# EAGLE design momav_esc (EAGLE 9.6.1)
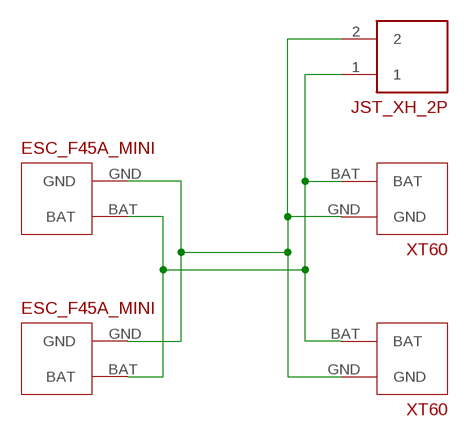
[diagram p0: schematic, sheet 1]

## Parts
U$1  ESC_F45A_MINI  [ESC_F45A_MINI]
U$2  ESC_F45A_MINI  [ESC_F45A_MINI]
U$3  CONN_XT60  [CONN_XT60]
U$4  CONN_XT60  [CONN_XT60]
U$5  JST_XH_2P  [JST_XH_2P]

## Nets
N$1: U$1.GND U$2.GND U$3.GND U$4.GND U$5.2
N$4: U$1.BAT U$2.BAT U$3.BAT U$4.BAT U$5.1

## Library data of the parts
U$1 U$2 = _custom:ESC_F45A_MINI
U$3 U$4 = _custom:CONN_XT60
U$5 = _custom:JST_XH_2P

## Board
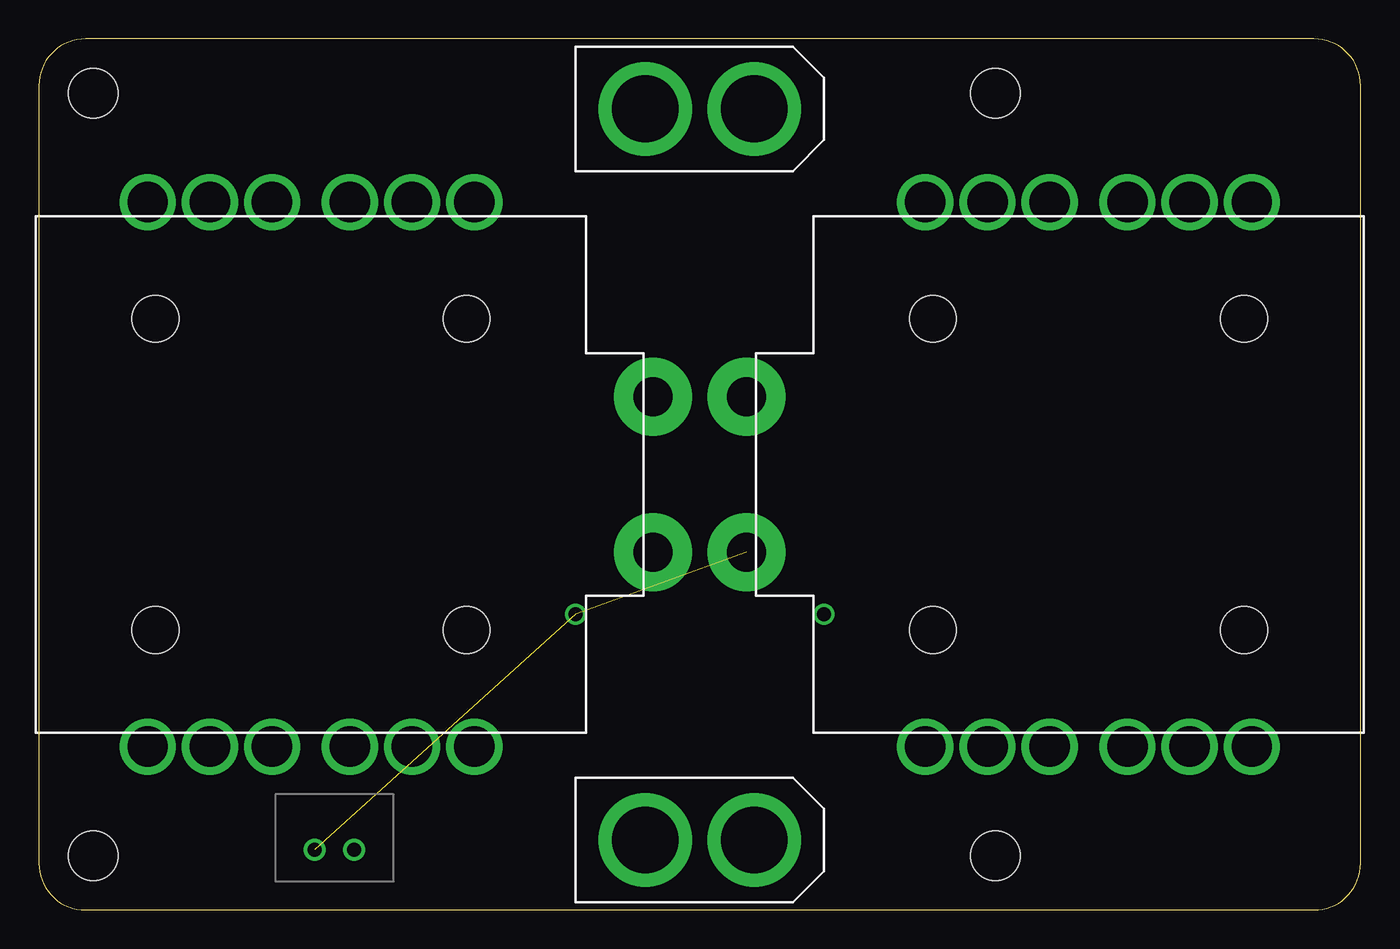
[diagram p1: board, top side]
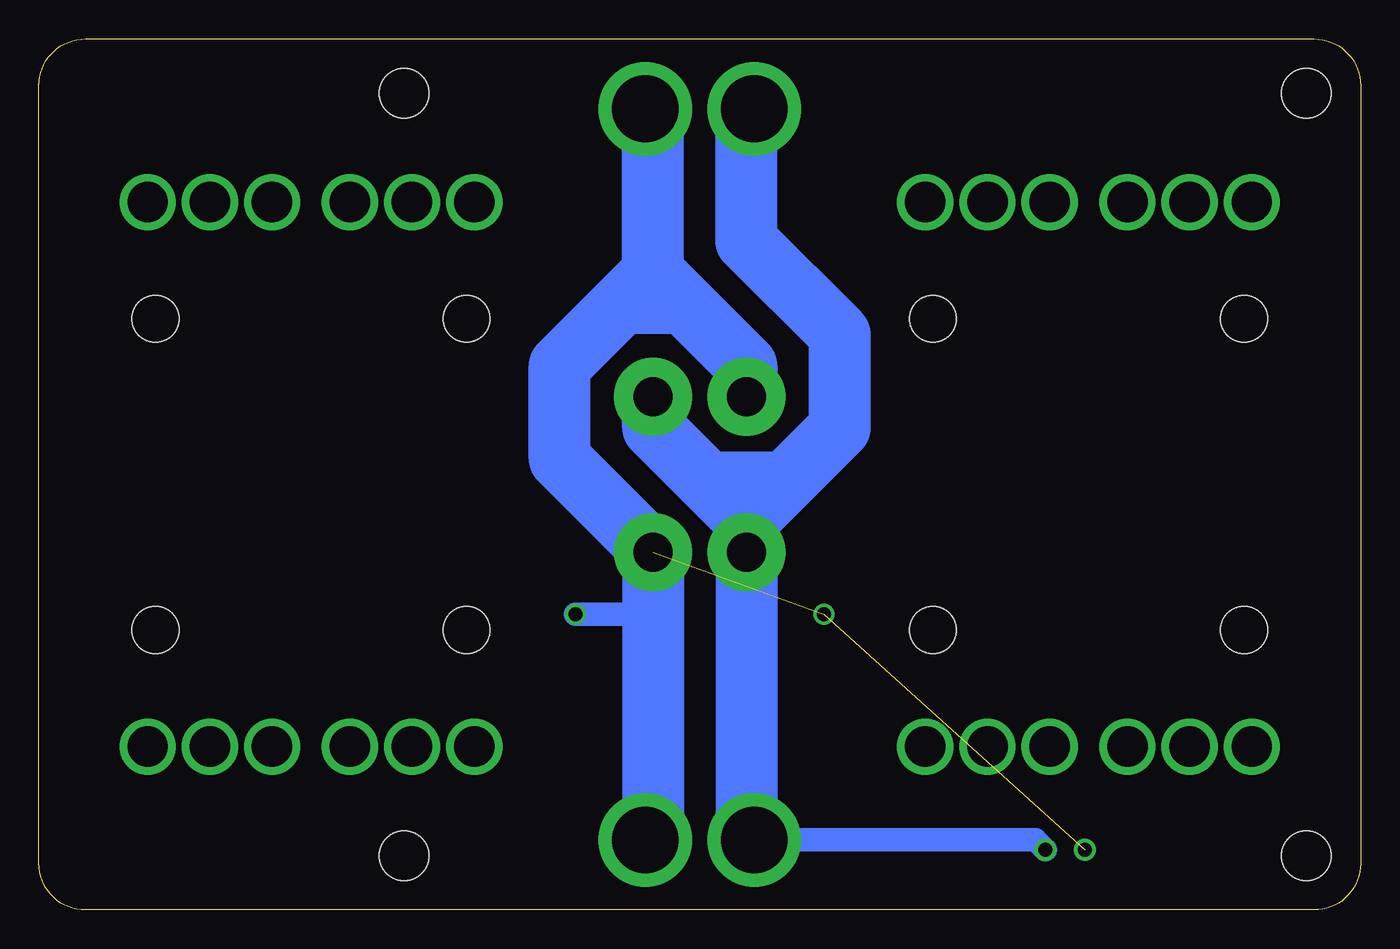
[diagram p2: board, bottom side, seen from below]

Size 85 x 56 mm. Coordinates in mm from the lower left corner, seen from the top.
Outline: 0,53 0,3 arc90 3,0 82,0 arc90 85,3 85,53 arc90 82,56 3,56 arc90 0,53
Copper layers (1*16): Top 0.035mm / dielectric 1.5mm / Bottom 0.035mm
Design rules "default": minimum track width 6mil, minimum drill 0.35mm, track to track 6mil, track to pad 6mil, pad to pad 6mil, via to via 6mil, smd to smd 6mil, copper to edge 40mil, drill to drill 6mil, minimum pad ring 10mil, minimum via ring 8mil, stop-mask expansion 4mil, vias tented up to drill 0mil, thermal gap 10mil
Holes 3.17 mm at 3.5,52.5 61.5,52.5 61.5,3.5 3.5,3.5

### Footprints (pad centres in the part's own frame; a part is rotated, then mirrored left to right if it is on the bottom)
ESC_F45A_MINI = drill 2.5 pad 5: BAT 22,-5; GND 22,5 | drill 2.6 pad 3.6: M1A 2.5,17.5; M1B 6.5,17.5; M1C 10.5,17.5; M2A -10.5,17.5; M2B -6.5,17.5; M2C -2.5,17.5; M3A 2.5,-17.5; M3B 6.5,-17.5; M3C 10.5,-17.5; M4A -10.5,-17.5; M4B -6.5,-17.5; M4C -2.5,-17.5 | hole 3: -10,10; 10,10; 10,-10; -10,-10
CONN_XT60 = drill 4.3 pad 6: BAT 3.5,0; GND -3.5,0
JST_XH_2P = drill 0.9: 1 -1.27,0; 2 1.27,0

### Placement (x,y rotation side)
U$1  17.5,28 0 top
U$2  67.5,28 180 top
U$3  42.5,51.5 180 top
U$4  42.5,4.5 180 top
U$5  19,3.87 180 top

### Tracks (layer width: path | path; a pad name or v marks a point on that pad's centre or on a via)
N$1  (via drill 0.9)  (2 unrouted)
  Bottom 1.5: v50.5,19 45.5,19
  Bottom 4: U$4.GND 45.5,5 45.5,19 U$2.GND 51.5,29 51.5,35 47.5,39 | 47.5,39 45.5,41 | 45.5,41 45.5,51 U$3.GND | 45.5,41 43.5,39 | 43.5,39 39.5,35 U$1.GND | 43.5,39 47.5,39
  other vias: 34.5,19
N$4
  Bottom 1.5: 38.5,4 39.5,5 | U$4.BAT 20.9,4.5 U$5.1
  Bottom 4: U$4.BAT 39.5,5 U$1.BAT 39.5,25 | 39.5,25 42,27.5 | 42,27.5 45.5,31 U$2.BAT | 39.5,25 37,27.5 | 37,27.5 33.5,31 33.5,37 39.5,43 39.5,51 U$3.BAT | 42,27.5 37,27.5